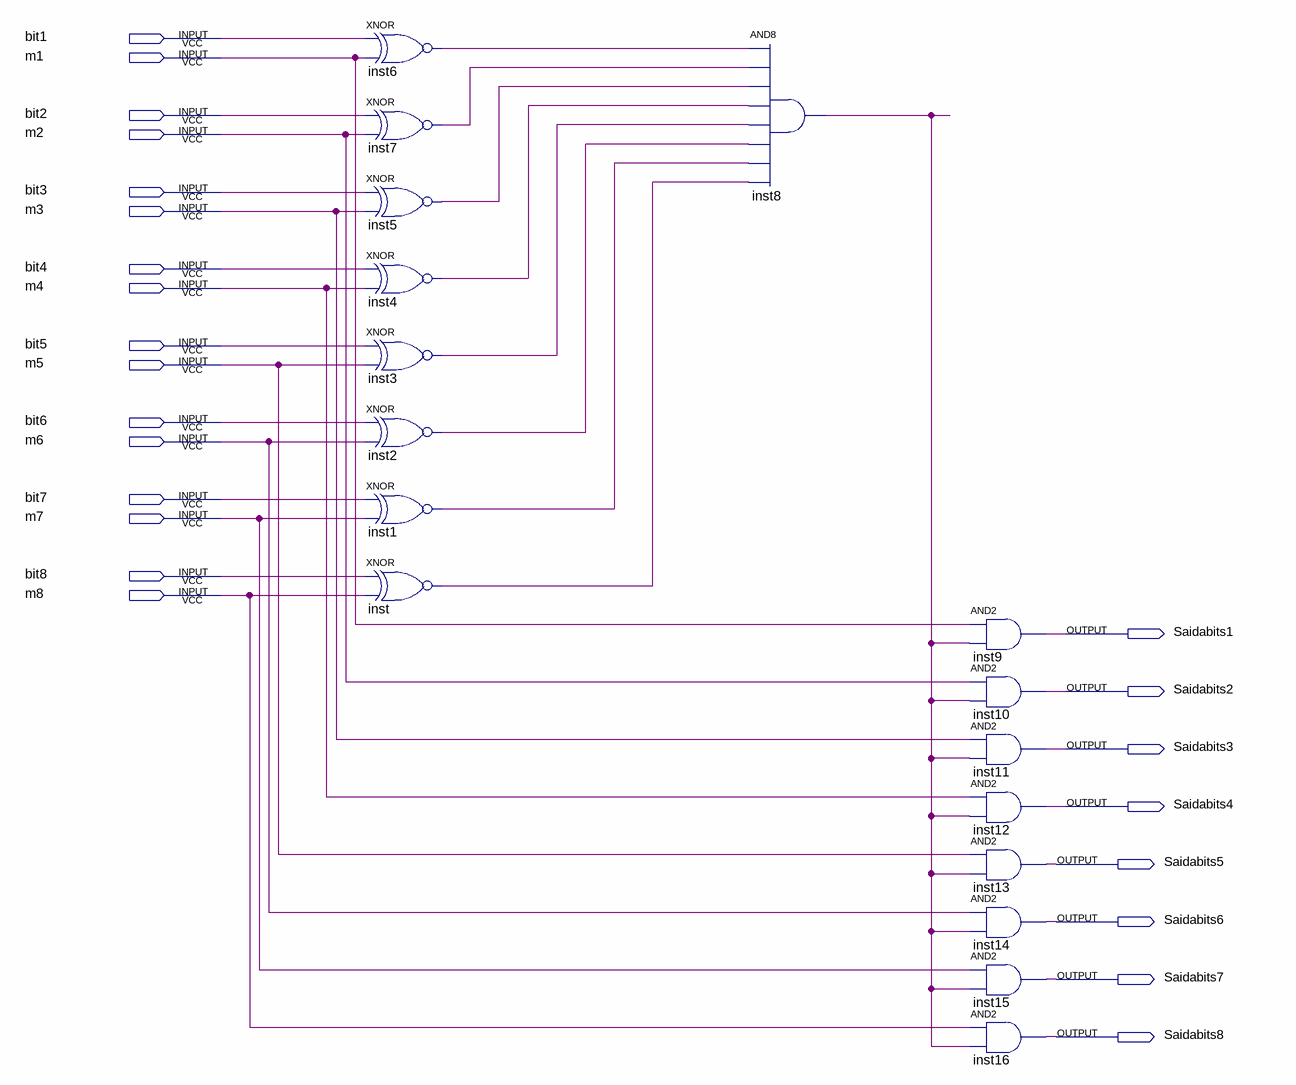
[diagram p0: schematic sheet]
// Quartus schematic Comparador8bits.bdf as structural Verilog: 17 symbols, 24 pins
module Comparador8bits (
  input  bit1,
  input  m1,
  input  bit2,
  input  m2,
  input  bit3,
  input  m3,
  input  bit4,
  input  m4,
  input  bit5,
  input  m5,
  input  bit6,
  input  m6,
  input  bit7,
  input  m7,
  input  bit8,
  input  m8,
  output Saidabits1,
  output Saidabits2,
  output Saidabits3,
  output Saidabits4,
  output Saidabits5,
  output Saidabits6,
  output Saidabits7,
  output Saidabits8
);

  wire inst1_out, inst2_out, inst3_out, inst4_out, inst5_out, inst6_out, inst7_out, inst8_out, inst_out;

  xnor inst6 (inst6_out, bit1, m1);
  xnor inst7 (inst7_out, bit2, m2);
  xnor inst5 (inst5_out, bit3, m3);
  xnor inst4 (inst4_out, bit4, m4);
  xnor inst3 (inst3_out, bit5, m5);
  xnor inst2 (inst2_out, bit6, m6);
  xnor inst1 (inst1_out, bit7, m7);
  xnor inst (inst_out, bit8, m8);
  and inst8 (inst8_out, inst6_out, inst7_out, inst5_out, inst4_out, inst3_out, inst2_out, inst1_out, inst_out);
  and inst9 (Saidabits1, m1, inst8_out);
  and inst10 (Saidabits2, m2, inst8_out);
  and inst11 (Saidabits3, m3, inst8_out);
  and inst12 (Saidabits4, m4, inst8_out);
  and inst13 (Saidabits5, m5, inst8_out);
  and inst14 (Saidabits6, m6, inst8_out);
  and inst15 (Saidabits7, m7, inst8_out);
  and inst16 (Saidabits8, m8, inst8_out);
endmodule
